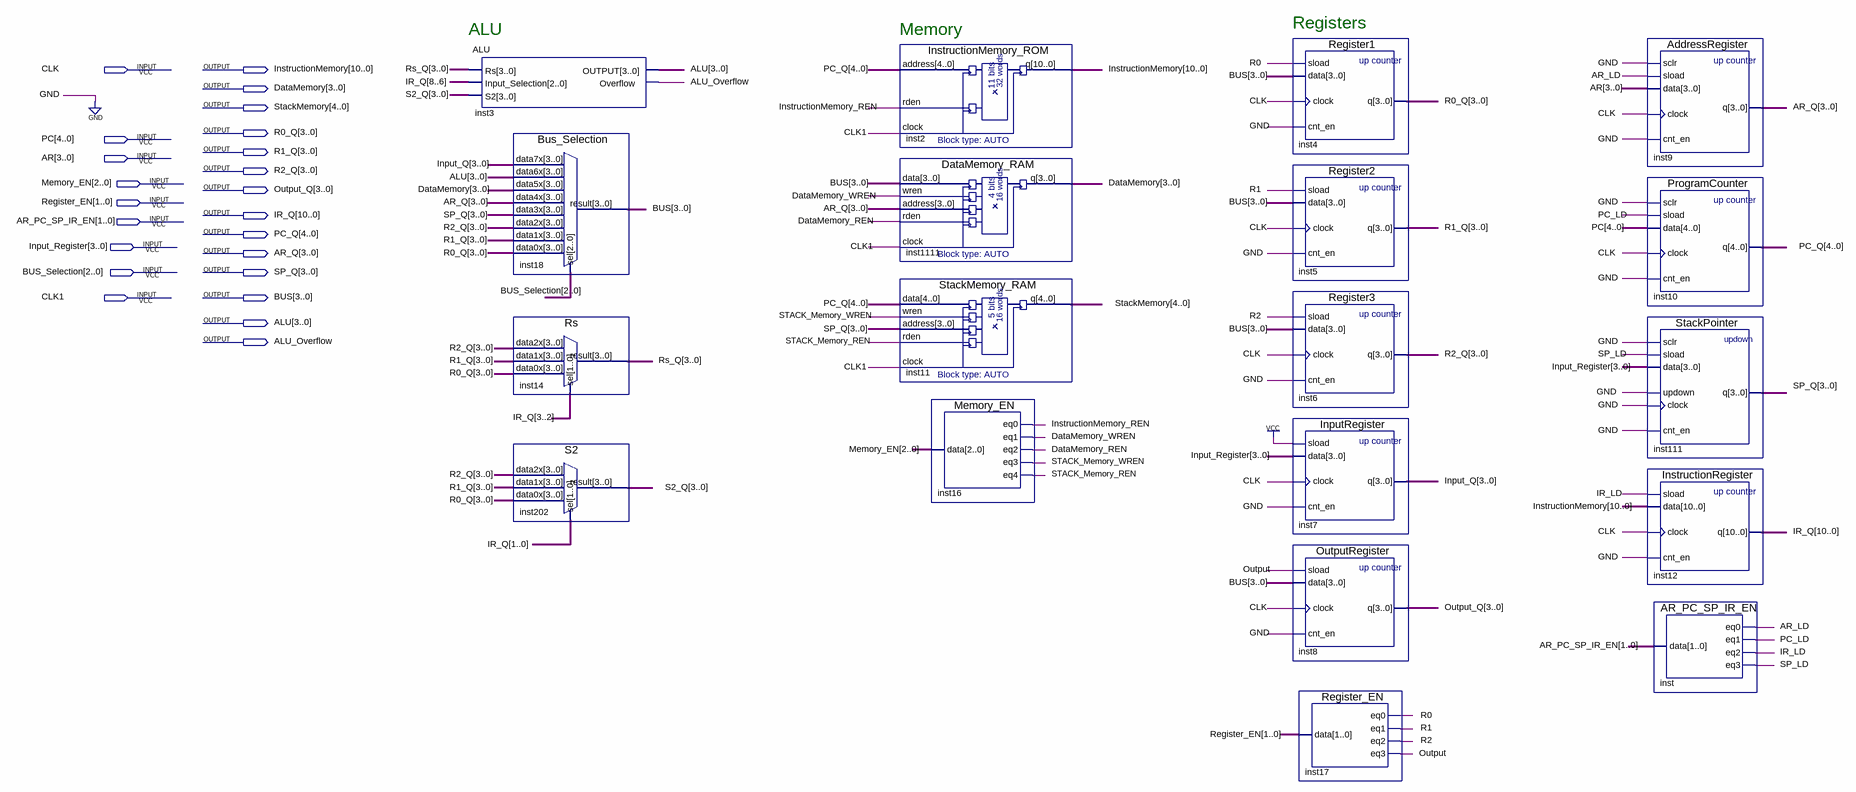
[diagram p0: schematic sheet]
// Quartus schematic Kasra_2022510011_Group31_BUS.bdf as structural Verilog: 19 symbols, 23 pins
module Kasra_2022510011_Group31_BUS (
  input  CLK,
  input  [4:0] PC,
  input  [3:0] AR,
  input  [2:0] Memory_EN,
  input  [1:0] Register_EN,
  input  [1:0] AR_PC_SP_IR_EN,
  input  [3:0] Input_Register,
  input  [2:0] BUS_Selection,
  input  CLK1,
  output [10:0] InstructionMemory,
  output [3:0] DataMemory,
  output [4:0] StackMemory,
  output [3:0] R0_Q,
  output [3:0] R1_Q,
  output [3:0] R2_Q,
  output [3:0] Output_Q,
  output [10:0] IR_Q,
  output [4:0] PC_Q,
  output [3:0] AR_Q,
  output [3:0] SP_Q,
  output [3:0] BUS,
  output [3:0] ALU,
  output ALU_Overflow
);

  wire AR_LD, DataMemory_REN, DataMemory_WREN, InstructionMemory_REN, IR_LD, Output, PC_LD, R0, R1, R2,
       SP_LD, STACK_Memory_REN, STACK_Memory_WREN;
  wire [3:0] Input_Q, Rs_Q, S2_Q;

  ALU inst3 (.Rs(Rs_Q), .Input_Selection(IR_Q[8:6]), .S2(S2_Q), .OUTPUT(ALU), .Overflow(ALU_Overflow));
  Bus_Selection inst18 (
    .data7x(Input_Q), .data6x(ALU), .data5x(DataMemory), .data4x(AR_Q), .data3x(SP_Q), .data2x(R2_Q),
    .data1x(R1_Q), .data0x(R0_Q), .sel(BUS_Selection), .result(BUS));
  Rs inst14 (.data2x(R2_Q), .data1x(R1_Q), .data0x(R0_Q), .sel(IR_Q[3:2]), .result(Rs_Q));
  S2 inst202 (.data2x(R2_Q), .data1x(R1_Q), .data0x(R0_Q), .sel(IR_Q[1:0]), .result(S2_Q));
  InstructionMemory_ROM inst2 (.address(PC_Q), .rden(InstructionMemory_REN), .clock(CLK1), .q(InstructionMemory));
  DataMemory_RAM inst1111 (
    .data(BUS), .wren(DataMemory_WREN), .address(AR_Q), .rden(DataMemory_REN), .clock(CLK1), .q(DataMemory));
  StackMemory_RAM inst11 (
    .data(PC_Q), .wren(STACK_Memory_WREN), .address(SP_Q), .rden(STACK_Memory_REN), .clock(CLK1),
    .q(StackMemory));
  Memory_EN inst16 (
    .data(Memory_EN), .eq0(InstructionMemory_REN), .eq1(DataMemory_WREN), .eq2(DataMemory_REN),
    .eq3(STACK_Memory_WREN), .eq4(STACK_Memory_REN));
  Register1 inst4 (.sload(R0), .data(BUS), .clock(CLK), .cnt_en(1'b0), .q(R0_Q));
  Register2 inst5 (.sload(R1), .data(BUS), .clock(CLK), .cnt_en(1'b0), .q(R1_Q));
  Register3 inst6 (.sload(R2), .data(BUS), .clock(CLK), .cnt_en(1'b0), .q(R2_Q));
  InputRegister inst7 (.sload(1'b1), .data(Input_Register), .clock(CLK), .cnt_en(1'b0), .q(Input_Q));
  OutputRegister inst8 (.sload(Output), .data(BUS), .clock(CLK), .cnt_en(1'b0), .q(Output_Q));
  Register_EN inst17 (.data(Register_EN), .eq0(R0), .eq1(R1), .eq2(R2), .eq3(Output));
  AddressRegister inst9 (.sclr(1'b0), .sload(AR_LD), .data(AR), .clock(CLK), .cnt_en(1'b0), .q(AR_Q));
  ProgramCounter inst10 (.sclr(1'b0), .sload(PC_LD), .data(PC), .clock(CLK), .cnt_en(1'b0), .q(PC_Q));
  StackPointer inst111 (
    .sclr(1'b0), .sload(SP_LD), .data(Input_Register), .updown(1'b0), .clock(1'b0), .cnt_en(1'b0), .q(SP_Q));
  InstructionRegister inst12 (.sload(IR_LD), .data(InstructionMemory), .clock(CLK), .cnt_en(1'b0), .q(IR_Q));
  AR_PC_SP_IR_EN inst (.data(AR_PC_SP_IR_EN), .eq0(AR_LD), .eq1(PC_LD), .eq2(IR_LD), .eq3(SP_LD));

  // Notes on the sheet:
  //   Registers
  //   ALU
  //   Memory
endmodule
